# Altium project ТЕИЯ.464511.002 main.PrjPcb (part 2 of 3)

## Sheet Модуль MCU.SchDoc
size 420 x 297 mm; DocumentNumber: 8; SheetNumber: 8; SheetTotal: 11; ListNumber: 1
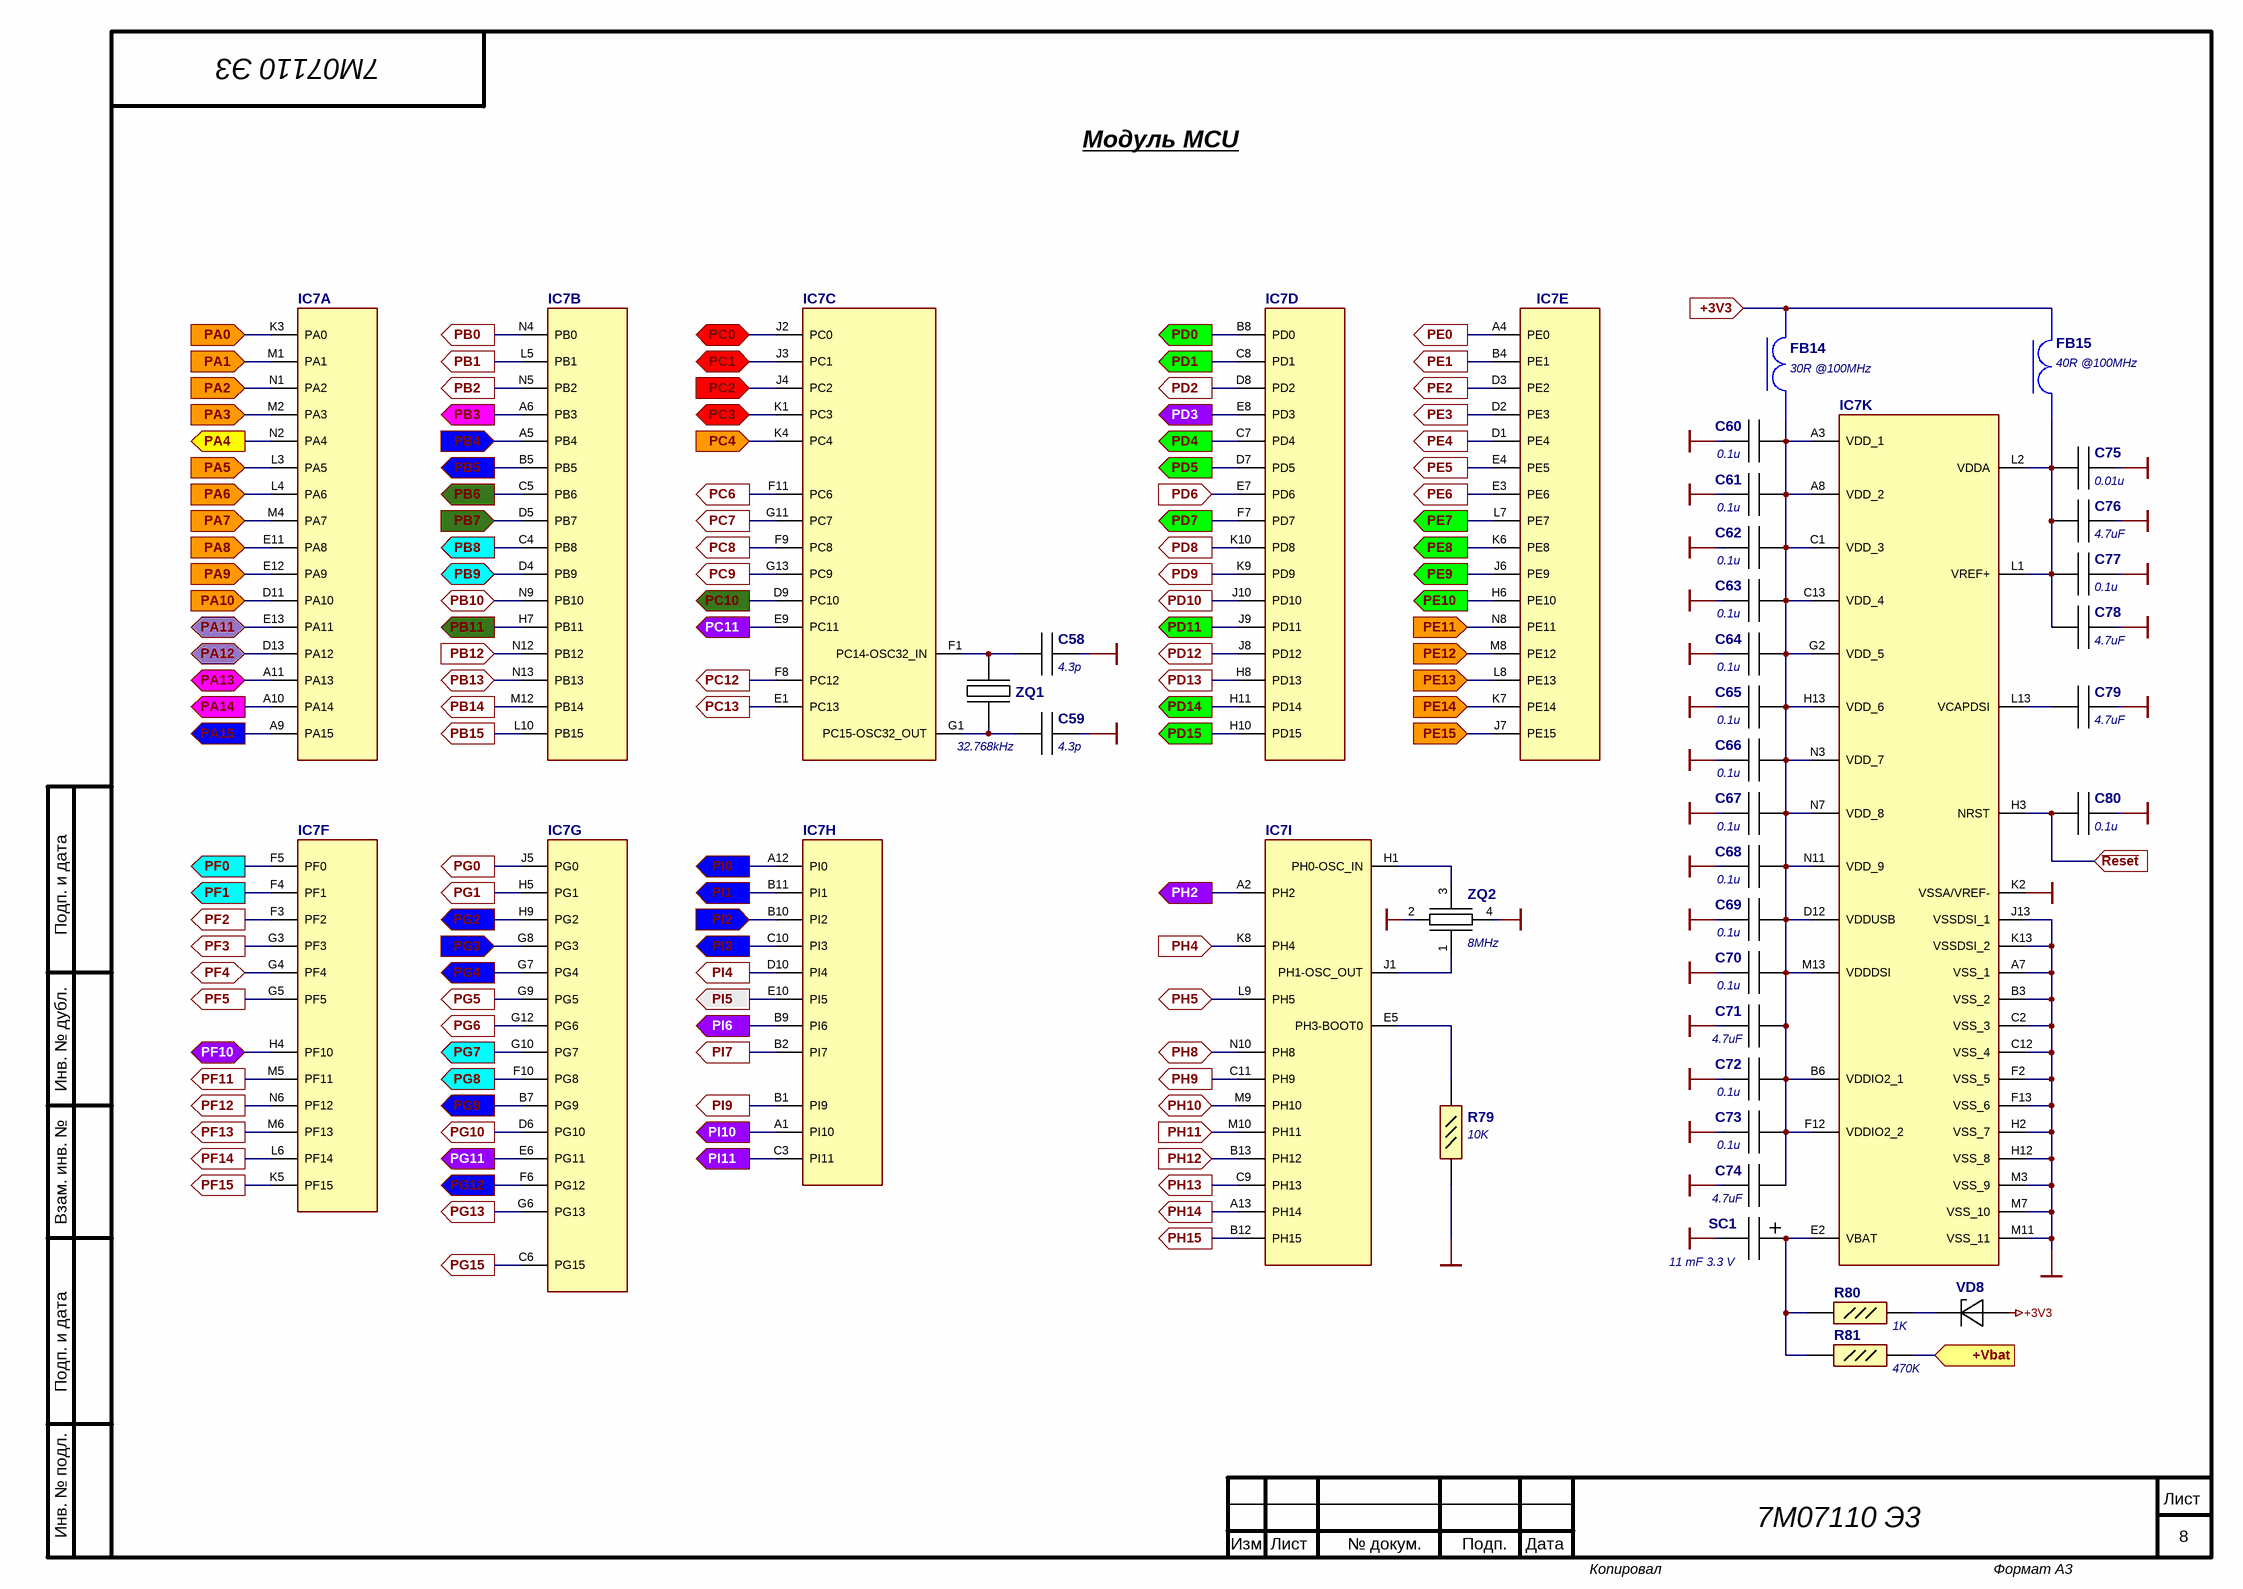
[diagram p5: Модуль MCU.SchDoc]

### Parts
C58  4.3p  [:CAP0402 100x50x50]
C59  4.3p  [:CAP0402 100x50x50]
C60  0.1u  [:CAP0402 100x50x50]
C61  0.1u  [:CAP0402 100x50x50]
C62  0.1u  [:CAP0402 100x50x50]
C63  0.1u  [:CAP0402 100x50x50]
C64  0.1u  [:CAP0402 100x50x50]
C65  0.1u  [:CAP0402 100x50x50]
C66  0.1u  [:CAP0402 100x50x50]
C67  0.1u  [:CAP0402 100x50x50]
C68  0.1u  [:CAP0402 100x50x50]
C69  0.1u  [:CAP0402 100x50x50]
C70  0.1u  [:CAP0402 100x50x50]
C71  4.7uF  [:CAP0805 C2012X125]
C72  0.1u  [:CAP0402 100x50x50]
C73  0.1u  [:CAP0402 100x50x50]
C74  4.7uF  [:CAP0805 C2012X125]
C75  0.01u  [:CAP0402 100x50x50]
C76  4.7uF  [:CAP0805 C2012X125]
C77  0.1u  [:CAP0402 100x50x50]
C78  4.7uF  [:CAP0805 C2012X125]
C79  4.7uF  [:CAP0805 C2012X125]
C80  0.1u  [:CAP0402 100x50x50]
FB14  30R @100MHz  [:FER BLM18SP300SN1D]
FB15  40R @100MHz  [:FER MMZ1005Y400CTD25]
IC7  STM32L4S9AII6  [:BGA169 P700X700X60]  (value not drawn)  (parts A,B,C,D,E,F,G,H,I,K of 11)
R79  Manufacturer_Part_Number (part 2: value): 10K  [:RES0402]  (hidden comment: RC0402FR-07)
R80  Manufacturer_Part_Number (part 2: value): 1K  [:RES0402]  (hidden comment: RC0402FR-07)
R81  Manufacturer_Part_Number (part 2: value): 470K  [:RES0402]  (hidden comment: RC0402FR-07)
SC1  11 mF 3.3 V  [:CAP CPH3225A]
VD8  30V 0.1A  [:DIODE SOD-923F]  (value not drawn)
ZQ1  32.768kHz  [:RESO 12.87181]
ZQ2  8MHz  [:RESO LFXTAL069277REEL]

### Ports
+3V3 (in), +Vbat (in), PA0 (in), PA1 (in), PA2 (in), PA3 (in), PA4 (out), PA5 (in), PA6 (in), PA7 (in), PA8 (in), PA9 (in), PA10 (in), PA11 (bidir), PA12 (bidir), PA13 (bidir), PA14 (out), PA15 (out), PB0 (out), PB1 (out), PB2 (out), PB3 (out), PB4 (in), PB5 (out), PB6 (out), PB7 (in), PB8 (out), PB9 (bidir), PB10 (bidir), PB11 (out), PB12 (in), PB13 (bidir), PB14 (out), PB15 (out), PC0 (bidir), PC1 (bidir), PC2 (in), PC3 (bidir), PC4 (in), PC6 (out), PC7 (out), PC8 (out), PC9 (out), PC10 (out), PC11 (out), PC12 (out), PC13 (out), PD0 (out), PD1 (out), PD2 (out), PD3 (out), PD4 (out), PD5 (out), PD6 (in), PD7 (out), PD8 (out), PD9 (out), PD10 (out), PD11 (out), PD12 (out), PD13 (out), PD14 (out), PD15 (out), PE0 (out), PE1 (out), PE2 (out), PE3 (out), PE4 (out), PE5 (out), PE6 (out), PE7 (out), PE8 (out), PE9 (out), PE10 (out), PE11 (in), PE12 (in), PE13 (in), PE14 (in), PE15 (in), PF0 (out), PF1 (out), PF2 (out), PF3 (out), PF4 (bidir), PF5 (out), PF10 (bidir), PF11 (out), PF12 (out), PF13 (out), PF14 (out), PF15 (out), PG0 (out), PG1 (out), PG2 (out), PG3 (in), PG4 (out), PG5 (out), PG6 (out), PG7 (out), PG8 (out), PG9 (out), PG10 (out), PG11 (out), PG12 (out), PG13 (out), PG15 (out), PH2 (out), PH4 (in), PH5 (bidir), PH8 (bidir), PH9 (out), PH10 (bidir), PH11 (in), PH12 (in), PH13 (out), PH14 (out), PH15 (out), PI0 (out), PI1 (out), PI2 (in), PI3 (out), PI4 (out), PI5 (out), PI6 (out), PI7 (out), PI9 (out), PI10 (out), PI11 (out), ~{Reset} (in)

### Nets
+3V3: FB14.2 FB15.1 VD8.2(A) ; port +3V3
GND: C58.2 C59.2 C60.1 C61.1 C62.1 C63.1 C64.1 C65.1 C66.1 C67.1 C68.1 C69.1 C70.1 C71.2 C72.1 C73.1 C74.2 C75.2 C76.2 C77.2 C78.2 C79.2 C80.2 IC7.A7(VSS_1) IC7.B3(VSS_2) IC7.C2(VSS_3) IC7.C12(VSS_4) IC7.F2(VSS_5) IC7.F13(VSS_6) IC7.H2(VSS_7) IC7.H12(VSS_8) IC7.J13(VSSDSI_1) IC7.K2(VSSA/VREF-) IC7.K13(VSSDSI_2) IC7.M3(VSS_9) IC7.M7(VSS_10) IC7.M11(VSS_11) R79.1 SC1.2(-) ZQ2.2 ZQ2.4
PS_10V5_ON: IC7.J5(PG0) ; port PG0
PS_14V_ON: IC7.L6(PF14) ; port PF14
PS_-5V_ON: IC7.E3(PE6) ; port PE6
NetC1_1: IC7.D13(PA12) ; port PA12
NetC2_1: IC7.E13(PA11) ; port PA11
NetC3_1: IC7.A6(PB3) ; port PB3
NetC4_1: IC7.K7(PE14) ; port PE14
NetC5_1: IC7.D5(PB7) ; port PB7
NetC6_1: IC7.A10(PA14) ; port PA14
NetC7_1: C80.1 IC7.H3(NRST) ; port ~{Reset}
NetC8_1: IC7.C5(PB6) ; port PB6
NetC9_1: IC7.A11(PA13) ; port PA13
NetC10_1: IC7.D9(PC10) ; port PC10
NetC58_1: C58.1 IC7.F1(PC14-OSC32_IN) ZQ1.2
NetC59_1: C59.1 IC7.G1(PC15-OSC32_OUT) ZQ1.1
NetC60_2: C60.2 C61.2 C62.2 C63.2 C64.2 C65.2 C66.2 C67.2 C68.2 C69.2 C70.2 C71.1 C72.2 C73.2 C74.1 FB14.1 IC7.A3(VDD_1) IC7.A8(VDD_2) IC7.B6(VDDIO2_1) IC7.C1(VDD_3) IC7.C13(VDD_4) IC7.D12(VDDUSB) IC7.F12(VDDIO2_2) IC7.G2(VDD_5) IC7.H13(VDD_6) IC7.M13(VDDDSI) IC7.N3(VDD_7) IC7.N7(VDD_8) IC7.N11(VDD_9)
NetC75_1: C75.1 C76.1 C77.1 C78.1 FB15.2 IC7.L1(VREF+) IC7.L2(VDDA)
NetC79_1: C79.1 IC7.L13(VCAPDSI)
NetIC7_A1: IC7.A1(PI10) ; port PI10
NetIC7_A2: IC7.A2(PH2) ; port PH2
NetIC7_A4: IC7.A4(PE0) ; port PE0
NetIC7_A5: IC7.A5(PB4) ; port PB4
NetIC7_A9: IC7.A9(PA15) ; port PA15
NetIC7_A12: IC7.A12(PI0) ; port PI0
NetIC7_A13: IC7.A13(PH14) ; port PH14
NetIC7_B1: IC7.B1(PI9) ; port PI9
NetIC7_B2: IC7.B2(PI7) ; port PI7
NetIC7_B4: IC7.B4(PE1) ; port PE1
NetIC7_B5: IC7.B5(PB5) ; port PB5
NetIC7_B7: IC7.B7(PG9) ; port PG9
NetIC7_B8: IC7.B8(PD0) ; port PD0
NetIC7_B9: IC7.B9(PI6) ; port PI6
NetIC7_B10: IC7.B10(PI2) ; port PI2
NetIC7_B11: IC7.B11(PI1) ; port PI1
NetIC7_B12: IC7.B12(PH15) ; port PH15
NetIC7_B13: IC7.B13(PH12) ; port PH12
NetIC7_C3: IC7.C3(PI11) ; port PI11
NetIC7_C4: IC7.C4(PB8) ; port PB8
NetIC7_C6: IC7.C6(PG15) ; port PG15
NetIC7_C7: IC7.C7(PD4) ; port PD4
NetIC7_C8: IC7.C8(PD1) ; port PD1
NetIC7_C9: IC7.C9(PH13) ; port PH13
NetIC7_C10: IC7.C10(PI3) ; port PI3
NetIC7_C11: IC7.C11(PH9) ; port PH9
NetIC7_D1: IC7.D1(PE4) ; port PE4
NetIC7_D2: IC7.D2(PE3) ; port PE3
NetIC7_D3: IC7.D3(PE2) ; port PE2
NetIC7_D4: IC7.D4(PB9) ; port PB9
NetIC7_D6: IC7.D6(PG10) ; port PG10
NetIC7_D7: IC7.D7(PD5) ; port PD5
NetIC7_D8: IC7.D8(PD2) ; port PD2
NetIC7_D10: IC7.D10(PI4) ; port PI4
NetIC7_D11: IC7.D11(PA10) ; port PA10
NetIC7_E1: IC7.E1(PC13) ; port PC13
NetIC7_E2: IC7.E2(VBAT) R80.2 R81.2 SC1.1(+)
NetIC7_E4: IC7.E4(PE5) ; port PE5
NetIC7_E5: IC7.E5(PH3-BOOT0) R79.2
NetIC7_E6: IC7.E6(PG11) ; port PG11
NetIC7_E7: IC7.E7(PD6) ; port PD6
NetIC7_E8: IC7.E8(PD3) ; port PD3
NetIC7_E9: IC7.E9(PC11) ; port PC11
NetIC7_E10: IC7.E10(PI5) ; port PI5
NetIC7_E11: IC7.E11(PA8) ; port PA8
NetIC7_E12: IC7.E12(PA9) ; port PA9
NetIC7_F3: IC7.F3(PF2) ; port PF2
NetIC7_F4: IC7.F4(PF1) ; port PF1
NetIC7_F5: IC7.F5(PF0) ; port PF0
NetIC7_F6: IC7.F6(PG12) ; port PG12
NetIC7_F7: IC7.F7(PD7) ; port PD7
NetIC7_F8: IC7.F8(PC12) ; port PC12
NetIC7_F9: IC7.F9(PC8) ; port PC8
NetIC7_F10: IC7.F10(PG8) ; port PG8
NetIC7_F11: IC7.F11(PC6) ; port PC6
NetIC7_G3: IC7.G3(PF3) ; port PF3
NetIC7_G4: IC7.G4(PF4) ; port PF4
NetIC7_G5: IC7.G5(PF5) ; port PF5
NetIC7_G6: IC7.G6(PG13) ; port PG13
NetIC7_G7: IC7.G7(PG4) ; port PG4
NetIC7_G8: IC7.G8(PG3) ; port PG3
NetIC7_G9: IC7.G9(PG5) ; port PG5
NetIC7_G10: IC7.G10(PG7) ; port PG7
NetIC7_G11: IC7.G11(PC7) ; port PC7
NetIC7_G12: IC7.G12(PG6) ; port PG6
NetIC7_G13: IC7.G13(PC9) ; port PC9
NetIC7_H1: IC7.H1(PH0-OSC_IN) ZQ2.3
NetIC7_H4: IC7.H4(PF10) ; port PF10
NetIC7_H5: IC7.H5(PG1) ; port PG1
NetIC7_H6: IC7.H6(PE10) ; port PE10
NetIC7_H7: IC7.H7(PB11) ; port PB11
NetIC7_H8: IC7.H8(PD13) ; port PD13
NetIC7_H9: IC7.H9(PG2) ; port PG2
NetIC7_H10: IC7.H10(PD15) ; port PD15
NetIC7_H11: IC7.H11(PD14) ; port PD14
NetIC7_J1: IC7.J1(PH1-OSC_OUT) ZQ2.1
NetIC7_J2: IC7.J2(PC0) ; port PC0
NetIC7_J3: IC7.J3(PC1) ; port PC1
NetIC7_J4: IC7.J4(PC2) ; port PC2
NetIC7_J6: IC7.J6(PE9) ; port PE9
NetIC7_J7: IC7.J7(PE15) ; port PE15
NetIC7_J8: IC7.J8(PD12) ; port PD12
NetIC7_J9: IC7.J9(PD11) ; port PD11
NetIC7_J10: IC7.J10(PD10) ; port PD10
NetIC7_K1: IC7.K1(PC3) ; port PC3
NetIC7_K3: IC7.K3(PA0) ; port PA0
NetIC7_K4: IC7.K4(PC4) ; port PC4
NetIC7_K5: IC7.K5(PF15) ; port PF15
NetIC7_K6: IC7.K6(PE8) ; port PE8
NetIC7_K8: IC7.K8(PH4) ; port PH4
NetIC7_K9: IC7.K9(PD9) ; port PD9
NetIC7_K10: IC7.K10(PD8) ; port PD8
NetIC7_L3: IC7.L3(PA5) ; port PA5
NetIC7_L4: IC7.L4(PA6) ; port PA6
NetIC7_L5: IC7.L5(PB1) ; port PB1
NetIC7_L7: IC7.L7(PE7) ; port PE7
NetIC7_L8: IC7.L8(PE13) ; port PE13
NetIC7_L9: IC7.L9(PH5) ; port PH5
NetIC7_L10: IC7.L10(PB15) ; port PB15
NetIC7_M1: IC7.M1(PA1) ; port PA1
NetIC7_M2: IC7.M2(PA3) ; port PA3
NetIC7_M4: IC7.M4(PA7) ; port PA7
NetIC7_M5: IC7.M5(PF11) ; port PF11
NetIC7_M6: IC7.M6(PF13) ; port PF13
NetIC7_M8: IC7.M8(PE12) ; port PE12
NetIC7_M9: IC7.M9(PH10) ; port PH10
NetIC7_M10: IC7.M10(PH11) ; port PH11
NetIC7_M12: IC7.M12(PB14) ; port PB14
NetIC7_N1: IC7.N1(PA2) ; port PA2
NetIC7_N2: IC7.N2(PA4) ; port PA4
NetIC7_N4: IC7.N4(PB0) ; port PB0
NetIC7_N5: IC7.N5(PB2) ; port PB2
NetIC7_N6: IC7.N6(PF12) ; port PF12
NetIC7_N8: IC7.N8(PE11) ; port PE11
NetIC7_N9: IC7.N9(PB10) ; port PB10
NetIC7_N10: IC7.N10(PH8) ; port PH8
NetIC7_N12: IC7.N12(PB12) ; port PB12
NetIC7_N13: IC7.N13(PB13) ; port PB13
NetR50_1: R81.1 ; port +Vbat
NetR80_1: R80.1 VD8.1(K)

### Notes on the sheet
- Модуль MCU
- Подп. и дата
- Инв. № дубл.
- Взам. инв. №
- Инв. № подл.
- Лист
- Изм.
- № докум.
- Подп.
- Дата
- Копировал
- Формат А3

### Library data of the parts
C58 C59 = GJM1555C1H4R3CB01D: CAP CER  50V C0G/NP0 0402; Manufacturer_Name: Murata Electronics; Short Description: 0402 4.3p 50V; Manufacturer_Part_Number: GJM1555C1H4R3CB01D
C60-C70 C72 C73 C77 C80 = GRM155R71E104KE14J: ±10% 25V Ceramic Capacitor X7R 0402 (1005 Metric); Manufacturer_Name: Murata Electronics; Short Description: 0402 0.1uF 25V; Datasheet Link: http://www.murata.com/~/media/webrenewal/support/library/catalog/products/capacitor/mlcc/c02e.pdf; Height: 0.55mm; Manufacturer_Part_Number: GRM155R71E104KE14J; Mouser Part Number: 81-GRM155R71E104KE4J; Mouser Price/Stock: https://www.mouser.co.uk/ProductDetail/Murata-Electronics/GRM155R71E104KE14J?qs=hNud%2FORuBR2EQtvG2InwAQ%3D%3D; Arrow Part Number: GRM155R71E104KE14J; Arrow Price/Stock: https://www.arrow.com/en/products/grm155r71e104ke14j/murata-manufacturing
C71 C74 C76 C78 C79 = GRM21BZ71E475KE15L: CAP CER 4.7uF 25V X7R 0805; Manufacturer_Name: Murata Electronics; Short Description: 0805 4.7uF 25V; Datasheet Link: https://search.murata.co.jp/Ceramy/image/img/A01X/G101/ENG/GRM21BZ71E475KE15-01.pdf; Height: 1.45mm; Manufacturer_Part_Number: GRM21BZ71E475KE15L
C75 = GRM1555CYA103JE01D: ±5% 35V Ceramic Capacitor C0G, NP0 0402 (1005 Metric); Manufacturer_Name: Murata Electronics; Short Description: 0402 0.01u 35V; Datasheet Link: https://search.murata.co.jp/Ceramy/image/img/A01X/G101/ENG/GRM1555CYA103JE01-01A.pdf; Height: 0.55mm; Manufacturer_Part_Number: GRM1555CYA103JE01D
FB14 = BLM18SP300SN1D: 30 Ohms @ 100MHz 1 Power Line Ferrite Bead 0603 (1608 Metric) 6A 8mOhm; Manufacturer_Name: Murata Electronics; Short Description: 0603 30R @100MHz; Datasheet Link: http://www.murata.com/~/media/webrenewal/support/library/catalog/products/emc/emifil/c31e.ashx?la=en-gb; Height: 0.95mm; Manufacturer_Part_Number: BLM18SP300SN1D; Mouser Part Number: 81-BLM18SP300SN1D; Mouser Price/Stock: https://www.mouser.co.uk/ProductDetail/Murata-Electronics/BLM18SP300SN1D/?qs=W%2FMpXkg%252BdQ4o%252BOP%252B6m8FYA%3D%3D
FB15 = MMZ1005Y400CTD25: 40 Ohms @ 100MHz 1 Signal Line Ferrite Bead 0402 (1005 Metric) 550mA 100mOhm; Manufacturer_Name: TDK; Short Description: 0402 40R @100MHz; Datasheet Link: https://www.arrow.com/en/products/mmz1005y400ctd25/tdk; Height: 0.55mm; Manufacturer_Part_Number: MMZ1005Y400CTD25; Mouser Part Number: 810-MMZ1005Y400CTD25; Mouser Price/Stock: https://www.mouser.com/Search/Refine.aspx?Keyword=810-MMZ1005Y400CTD25; Arrow Part Number: MMZ1005Y400CTD25; Arrow Price/Stock: https://www.arrow.com/en/products/mmz1005y400ctd25/tdk
IC7 = STM32L4S9AII6: MCU 32BIT 2MB FLASH; Manufacturer_Name: STMicroelectronics; Datasheet Link: https://www.arrow.com/en/products/stm32l4s9aii6/stmicroelectronics; Height: 0.6mm; Manufacturer_Part_Number: STM32L4S9AII6; Mouser Part Number: 511-STM32L4S9AII6; Mouser Price/Stock: https://www.mouser.co.uk/ProductDetail/STMicroelectronics/STM32L4S9AII6?qs=wd5RIQLrsJhTDo%252BO4Z5Vcw%3D%3D; Arrow Part Number: STM32L4S9AII6; Arrow Price/Stock: https://www.arrow.com/en/products/stm32l4s9aii6/stmicroelectronics
R79-R81 = RC0402FR-07: as R1 on sheet 7М07110 Э3; Datasheet Link: http://www.yageo.com/documents/recent/PYu-RC0402_51_RoHS_L_6_r.pdf; Height: 0.4mm; Manufacturer_Part_Number: RC0402FR-07; Parameter 1: *
SC1 = CPH3225A: 11 mF (EDLC) Supercapacitor 3.3 V 1210 (3225 Metric); Manufacturer_Name: Seiko Instruments Micro Energy; Short Description: 1210 11mF 3.3V; Datasheet Link: https://www.sii.co.jp/en/me/datasheets/chip-capacitor/cph3225a/; Height: 1mm; Manufacturer_Part_Number: CPH3225A; Mouser Part Number: 628-CPH3225A; Mouser Price/Stock: https://www.mouser.com/Search/Refine.aspx?Keyword=628-CPH3225A
VD8 = CDBQR0130R: Diodes Schottky 0402 30V 0.1A; Manufacturer_Name: Comchip Technology; Datasheet Link: http://www.comchiptech.com/admin/files/product/CDBQR0130R-HF-RevC796140.pdf; Height: 0.55mm; Manufacturer_Part_Number: CDBQR0130R; Mouser Part Number: 750-CDBQR0130R; Mouser Price/Stock: https://www.mouser.co.uk/ProductDetail/Comchip-Technology/CDBQR0130R?qs=tw%252BuQ%2FB6PO3SSBtQ52w%2FCg%3D%3D; Arrow Part Number: CDBQR0130R; Arrow Price/Stock: https://www.arrow.com/en/products/cdbqr0130r/comchip-technology; Short Description: 0402 30V 0.1A
ZQ1 = 12.87181: CRYSTAL 32.7680KHZ / ±20ppm Crystal 12.5pF 2-SMD / ESR: 70 kOhms; Manufacturer_Name: Geyer Electronic America, Inc.; Manufacturer_Part_Number: 12.87181; Short Description: 32.768kHz
ZQ2 = LFXTAL069277REEL: CRYSTAL 8MHz / ±20ppm Crystal 20pF 4-SMD / ESR: 150 Ohms; Manufacturer_Name: IQD Frequency Products; Manufacturer_Part_Number: LFXTAL069277REEL; Short Description: 8MHz

## Sheet Модуль MMI.SchDoc
size 209 x 297 mm; DocumentNumber: 6; SheetNumber: 6; SheetTotal: 11; ListNumber: 1
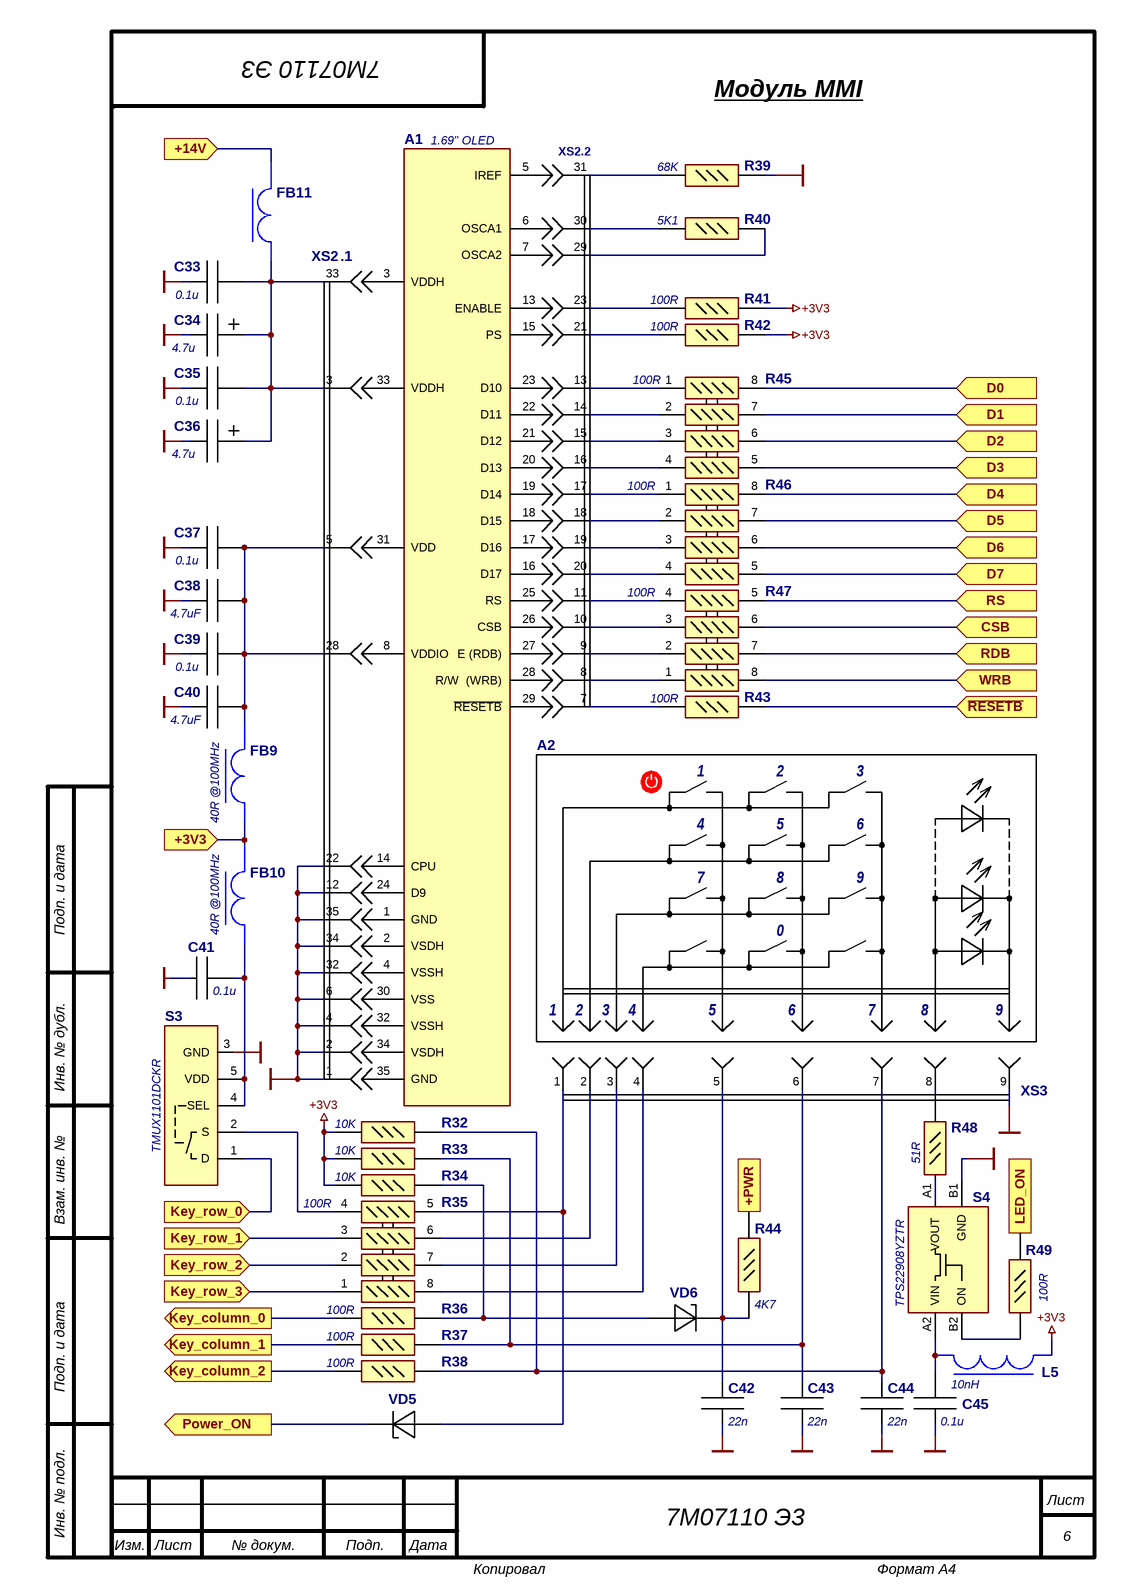
[diagram p6: Модуль MMI.SchDoc]

### Parts
A1  1.69" OLED
A2  (no value)
C33  0.1u  [:CAP0402 100x50x50]
C34  4.7u  [:CAP1206 C3216-18]
C35  0.1u  [:CAP0402 100x50x50]
C36  4.7u  [:CAP1206 C3216-18]
C37  0.1u  [:CAP0402 100x50x50]
C38  4.7uF  [:CAP0805 C2012X125]
C39  0.1u  [:CAP0402 100x50x50]
C40  4.7uF  [:CAP0805 C2012X125]
C41  0.1u  [:CAP0402 100x50x50]
C42  22n  [:CAP0402 100x50x50]
C43  22n  [:CAP0402 100x50x50]
C44  22n  [:CAP0402 100x50x50]
C45  0.1u  [:CAP0402 100x50x50]
FB9  40R @100MHz  [:FER MMZ1005Y400CTD25]
FB10  40R @100MHz  [:FER MMZ1005Y400CTD25]
FB11  40R @100MHz  [:FER MMZ1005Y400CTD25]  (value not drawn)
L5  10nH  [:IND 0402]
R32  Manufacturer_Part_Number (part 2: value): 10K  [:RES0402]  (hidden comment: RC0402FR-07)
R33  Manufacturer_Part_Number (part 2: value): 10K  [:RES0402]  (hidden comment: RC0402FR-07)
R34  Manufacturer_Part_Number (part 2: value): 10K  [:RES0402]  (hidden comment: RC0402FR-07)
R35  100R  [:RES0402x4]
R36  Manufacturer_Part_Number (part 2: value): 100R  [:RES0402]  (hidden comment: RC0402FR-07)
R37  Manufacturer_Part_Number (part 2: value): 100R  [:RES0402]  (hidden comment: RC0402FR-07)
R38  Manufacturer_Part_Number (part 2: value): 100R  [:RES0402]  (hidden comment: RC0402FR-07)
R39  Manufacturer_Part_Number (part 2: value): 68K  [:RES0402]  (hidden comment: RC0402FR-07)
R40  Manufacturer_Part_Number (part 2: value): 5K1  [:RES0402]  (hidden comment: RC0402FR-07)
R41  Manufacturer_Part_Number (part 2: value): 100R  [:RES0402]  (hidden comment: RC0402FR-07)
R42  Manufacturer_Part_Number (part 2: value): 100R  [:RES0402]  (hidden comment: RC0402FR-07)
R43  Manufacturer_Part_Number (part 2: value): 100R  [:RES0402]  (hidden comment: RC0402FR-07)
R44  Manufacturer_Part_Number (part 2: value): 4K7  [:RES0402]  (hidden comment: RC0402FR-07)
R45  100R  [:RES0402x4]
R46  100R  [:RES0402x4]
R47  100R  [:RES0402x4]
R48  Manufacturer_Part_Number (part 2: value): 51R  [:RES0402]  (hidden comment: RC0402FR-07)
R49  Manufacturer_Part_Number (part 2: value): 100R  [:RES0402]  (hidden comment: RC0402FR-07)
S3  TMUX1101DCKR  [:SC70 (5) P200X125X10]
S4  TPS22908YZTR  [:BGA4 P90X90X50]
VD5  30V 0.1A  [:DIODE SOD-923F]  (value not drawn)
VD6  30V 0.1A  [:DIODE SOD-923F]  (value not drawn)
XS2  0541043531  [541043531]  (value not drawn)
XS3  XF3M-0915-1B  [:CON XF3M-0915-1B]  (value not drawn)

### Ports
+3V3 (in), +14V (in), +PWR (in), CSB (in), D0 (in), D1 (in), D2 (in), D3 (in), D4 (in), D5 (in), D6 (in), D7 (in), Key_column_0 (out), Key_column_1 (out), Key_column_2 (out), Key_row_0 (in), Key_row_1 (in), Key_row_2 (in), Key_row_3 (in), LED_ON (in), Power_ON (out), RDB (in), RS (in), WRB (in), ~{RESETB} (in)

### Nets
+3V3: FB9.1 FB10.2 L5.2 R32.2 R33.2 R34.2 R41.2 R42.2 ; port +3V3
+14V: FB11.2 ; port +14V
+PWR: R44.1 ; port +PWR
GND: C33.1 C34.2 C35.1 C36.2 C37.1 C38.2 C39.1 C40.2 C41.1 C42.1 C43.1 C44.1 C45.2 R39.2 S3.3(GND) S4.B1(GND) XS2.1 XS2.2 XS2.4 XS2.6 XS2.12 XS2.22 XS2.32 XS2.34 XS2.35 XS3.9
PS_3V3_ON: VD5.1(K) ; port Power_ON
NetC33_2: C33.2 C34.1(+) C35.2 C36.1(+) FB11.1 XS2.3 XS2.33
NetC37_2: C37.2 C38.1 C39.2 C40.1 FB9.2 XS2.5 XS2.28
NetC41_2: C41.2 FB10.1 S3.4(SEL) S3.5(VDD)
NetC42_2: C42.2 R44.2 VD6.1(K) XS3.5
NetC43_2: C43.2 R33.1 R37.2 XS3.6
NetC44_2: C44.2 R32.1 R38.2 XS3.7
NetC45_1: C45.1 L5.1 S4.A2(VIN)
NetIC7_B2: R35.1 ; port Key_row_3
NetIC7_B8: R45.6 ; port D2
NetIC7_C7: R47.7 ; port RDB
NetIC7_C8: R45.5 ; port D3
NetIC7_D1: S3.1(D) ; port Key_row_0
NetIC7_D2: R35.3 ; port Key_row_1
NetIC7_D3: R35.2 ; port Key_row_2
NetIC7_D7: R47.8 ; port WRB
NetIC7_E4: R49.1 ; port LED_ON
NetIC7_F5: R43.2 ; port ~{RESETB}
NetIC7_F7: R47.6 ; port CSB
NetIC7_H6: R46.5 ; port D7
NetIC7_H10: R45.7 ; port D1
NetIC7_H11: R45.8 ; port D0
NetIC7_J6: R46.6 ; port D6
NetIC7_J9: R47.5 ; port RS
NetIC7_K6: R46.7 ; port D5
NetIC7_L7: R46.8 ; port D4
NetIC7_M1: R37.1 ; port Key_column_1
NetIC7_M2: R36.1 ; port Key_column_0
NetIC7_N1: R38.1 ; port Key_column_2
NetR34_1: R34.1 R36.2 VD6.2(A)
NetR35_4: R35.4 S3.2(S)
NetR35_5: R35.5 VD5.2(A) XS3.1
NetR35_6: R35.6 XS3.2(ч)
NetR35_7: R35.7 XS3.3
NetR35_8: R35.8 XS3.4
NetR39_1: R39.1 XS2.31
NetR40_1: R40.1 XS2.30
NetR40_2: R40.2 XS2.29
NetR41_1: R41.1 XS2.23
NetR42_1: R42.1 XS2.21
NetR43_1: R43.1 XS2.7
NetR45_1: R45.1 XS2.13
NetR45_2: R45.2 XS2.14
NetR45_3: R45.3 XS2.15
NetR45_4: R45.4 XS2.16
NetR46_1: R46.1 XS2.17
NetR46_2: R46.2 XS2.18
NetR46_3: R46.3 XS2.19
NetR46_4: R46.4 XS2.20
NetR47_1: R47.1 XS2.8
NetR47_2: R47.2 XS2.9
NetR47_3: R47.3 XS2.10
NetR47_4: R47.4 XS2.11
NetR48_1: R48.1 XS3.8
NetR48_2: R48.2 S4.A1(VOUT)
NetR49_2: R49.2 S4.B2(ON)

Not connected (* = marked no-connect by the designer): A1 1(GND) 2(VSDH) 3(VDDH) 4(VSSH) 5(IREF) 6(OSCA1) 7(OSCA2) 8(VDDIO) 13(ENABLE) 14(CPU) 15(PS) 16(D17) 17(D16) 18(D15) 19(D14) 20(D13) 21(D12) 22(D11) 23(D10) 24(D9) 25(RS) 26(CSB) 27(E_(RDB)) 28(R/W__(WRB)) 29(~{RESETB}) 30(VSS) 31(VDD) 32(VSSH) 33(VDDH) 34(VSDH) 35(GND)

### Notes on the sheet
- Модуль MMI
- (near XS2) XS2.2
- (near XS2) .1
- Подп. и дата
- Инв. № дубл.
- Взам. инв. №
- Инв. № подл.
- Лист
- Изм.
- № докум.
- Подп.
- Дата
- Копировал
- Формат А4
- (in symbol Клавиатура 3x4 (Заказ №...)) 1; 2; 3; 4; 5; 6; 7; 8; 9; 0

### Library data of the parts
A1 = NHD-1.69-160128G: Graphic LCD Display Module Transflective (RGB) / OLED Parallel, Serial 1.69" (42.93mm) 160 x 128; Manufacturer_Name: Newhaven Display; Manufacturer_Part_Number: NHD-1.69-160128G; Short Description: 1.69" OLED
A2 = Клавиатура 3x4 (Заказ №...): Клавиатура мембранная с подсветкой / Для серии будем заказывать изгтовление клавиатуры с подсветко по нашему ТЗ.; Manufacturer_Name: ООО «ИНЕЛСО»; Manufacturer_Part_Number: Клавиатура 5042 ТЕИЯ.464511.002 ТЗ
C33 C35 C37 C39 C41 C45 = GRM155R71E104KE14J: as C60 on sheet Модуль MCU; Datasheet Link: http://www.murata.com/~/media/webrenewal/support/library/catalog/products/capacitor/mlcc/c02e.pdf; Height: 0.55mm; Manufacturer_Part_Number: GRM155R71E104KE14J; Mouser Part Number: 81-GRM155R71E104KE4J; Mouser Price/Stock: https://www.mouser.co.uk/ProductDetail/Murata-Electronics/GRM155R71E104KE14J?qs=hNud%2FORuBR2EQtvG2InwAQ%3D%3D; Arrow Part Number: GRM155R71E104KE14J; Arrow Price/Stock: https://www.arrow.com/en/products/grm155r71e104ke14j/murata-manufacturing
C34 C36 = T491A475K025AT: 4.7µF Molded Tantalum Capacitors 25V 1206 (3216 Metric) 50mOhm; Manufacturer_Name: KEMET; Short Description: 1206 4.7µF 25V; Manufacturer_Part_Number: T491A475K025AT
C38 C40 = GRM21BZ71E475KE15L: as C71 on sheet Модуль MCU; Datasheet Link: https://search.murata.co.jp/Ceramy/image/img/A01X/G101/ENG/GRM21BZ71E475KE15-01.pdf; Height: 1.45mm; Manufacturer_Part_Number: GRM21BZ71E475KE15L
C42-C44 = GCM155R71E223KA55D: CAP CER  25V X7R 0402; Manufacturer_Name: Murata Electronics; Short Description: 0402 22n 25V; Manufacturer_Part_Number: GCM155R71E223KA55D
FB9-FB11 = MMZ1005Y400CTD25: as FB15 on sheet Модуль MCU; Datasheet Link: https://www.arrow.com/en/products/mmz1005y400ctd25/tdk; Height: 0.55mm; Manufacturer_Part_Number: MMZ1005Y400CTD25; Mouser Part Number: 810-MMZ1005Y400CTD25; Mouser Price/Stock: https://www.mouser.com/Search/Refine.aspx?Keyword=810-MMZ1005Y400CTD25; Arrow Part Number: MMZ1005Y400CTD25; Arrow Price/Stock: https://www.arrow.com/en/products/mmz1005y400ctd25/tdk
L5 = LQG15HN10NJ02D: Unshielded Multilayer Inductor 0402 5%; Manufacturer_Name: Murata Electronics; Short Description: 10nH 500mA 0.29Ohm; Manufacturer_Part_Number: LQG15HN10NJ02D
R32-R34 R36-R44 R48 R49 = RC0402FR-07: as R1 on sheet 7М07110 Э3; Datasheet Link: http://www.yageo.com/documents/recent/PYu-RC0402_51_RoHS_L_6_r.pdf; Height: 0.4mm; Manufacturer_Part_Number: RC0402FR-07; Parameter 1: *
R35 R45-R47 = EXB-N8V101JX: 100 Ohm ±5% 31mW Power Per Element Isolated 4 Resistor Network/Array ±200ppm/°C 0804, Concave, Long Side Terminals; Manufacturer_Name: Panasonic; Short Description: 0804 5% 100R; Datasheet Link: https://industrial.panasonic.com/cdbs/www-data/pdf/AOC0000/AOC0000C14.pdf; Height: 0.55mm; Manufacturer_Part_Number: EXB-N8V101JX; Mouser Part Number: 667-EXB-N8V101JX; Mouser Price/Stock: https://www.mouser.co.uk/ProductDetail/Panasonic/EXB-N8V101JX?qs=cttFivMKqWxyXyoXALoehw%3D%3D; Arrow Part Number: EXB-N8V101JX; Arrow Price/Stock: https://www.arrow.com/en/products/exbn8v101jx/panasonic
S3 = TMUX1101DCKR: SPST Switch Bidir. 1.8 Ω 30mA 300MHz; Manufacturer_Name: Texas Instruments; Datasheet Link: http://www.ti.com/lit/gpn/TMUX1101; Height: 1.1mm; Manufacturer_Part_Number: TMUX1101DCKR; Mouser Part Number: 595-TMUX1101DCKR; Mouser Price/Stock: https://www.mouser.co.uk/ProductDetail/Texas-Instruments/TMUX1101DCKR?qs=vLWxofP3U2x5rBu7DSMCxw%3D%3D; Arrow Part Number: TMUX1101DCKR; Arrow Price/Stock: https://www.arrow.com/en/products/tmux1101dckr/texas-instruments
S4 = TPS22908YZTR: SPST Switch 3.6-V, 1-A, 28-mΩ; Manufacturer_Name: Texas Instruments; Datasheet Link: http://www.ti.com/lit/gpn/tps22908; Height: 0.625mm; Manufacturer_Part_Number: TPS22908YZTR; Mouser Part Number: 595-TPS22908YZTR; Mouser Price/Stock: https://www.mouser.co.uk/ProductDetail/Texas-Instruments/TPS22908YZTR?qs=4whTb%2F0XQMjgQyC%252BYmbgaA%3D%3D; Arrow Part Number: TPS22908YZTR; Arrow Price/Stock: https://www.arrow.com/en/products/tps22908yztr/texas-instruments
VD5 VD6 = CDBQR0130R: as VD8 on sheet Модуль MCU; Datasheet Link: http://www.comchiptech.com/admin/files/product/CDBQR0130R-HF-RevC796140.pdf; Height: 0.55mm; Manufacturer_Part_Number: CDBQR0130R; Mouser Part Number: 750-CDBQR0130R; Mouser Price/Stock: https://www.mouser.co.uk/ProductDetail/Comchip-Technology/CDBQR0130R?qs=tw%252BuQ%2FB6PO3SSBtQ52w%2FCg%3D%3D; Arrow Part Number: CDBQR0130R; Arrow Price/Stock: https://www.arrow.com/en/products/cdbqr0130r/comchip-technology; Short Description: 0402 30V 0.1A
XS2 = 0541043531: Rotary Backlock Connector 35-pin 0.5mm Pitch, Top side Contact; Manufacturer_Name: Molex; Datasheet Link: https://componentsearchengine.com//54104-3531.pdf; Height: 2mm; Manufacturer_Part_Number: 0541043531; Short Description: 35-pin 0.5mm; Mouser2 Part Number: 538-54104-3531; Mouser2 Price/Stock: https://www.mouser.com/Search/Refine.aspx?Keyword=538-54104-3531
XS3 = XF3M-0915-1B: Rotary Backlock Connector 35-pin 0.5mm Pitch, Dual sided Contact; Manufacturer_Name: OMRON; Short Description: 9-pin 0.5mm; Manufacturer_Part_Number: XF3M-0915-1B

## Sheet Радиомодуль.SchDoc
size 209 x 297 mm; DocumentNumber: 10; SheetNumber: 10; SheetTotal: 11; ListNumber: 1
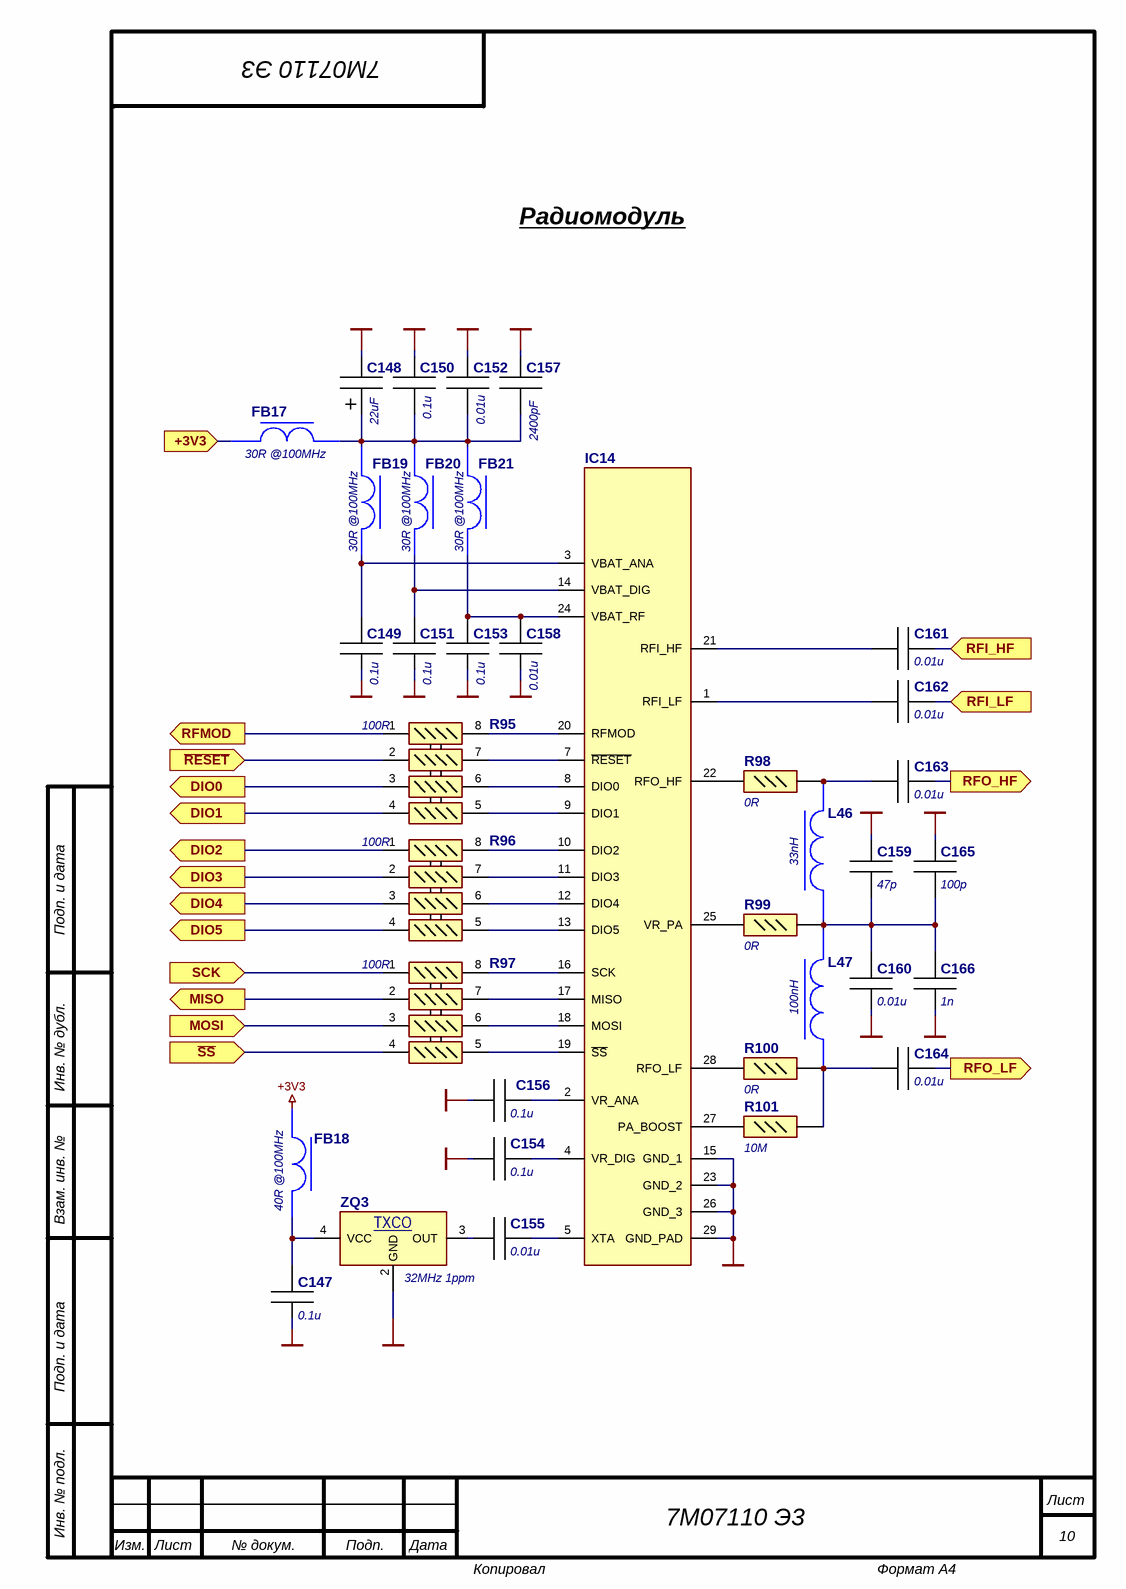
[diagram p7: Радиомодуль.SchDoc]

### Parts
C147  0.1u  [:CAP0402 100x50x50]
C148  22uF  [:CAP1206 C3216-18]
C149  0.1u  [:CAP0402 100x50x50]
C150  0.1u  [:CAP0402 100x50x50]
C151  0.1u  [:CAP0402 100x50x50]
C152  0.01u  [:CAP0402 100x50x50]
C153  0.1u  [:CAP0402 100x50x50]
C154  0.1u  [:CAP0402 100x50x50]
C155  0.01u  [:CAP0402 100x50x50]
C156  0.1u  [:CAP0402 100x50x50]
C157  2400pF  [:CAP0805 C2012X125]
C158  0.01u  [:CAP0402 100x50x50]
C159  47p  [:CAP0402 100x50x50]
C160  0.01u  [:CAP0402 100x50x50]
C161  0.01u  [:CAP0402 100x50x50]
C162  0.01u  [:CAP0402 100x50x50]
C163  0.01u  [:CAP0402 100x50x50]
C164  0.01u  [:CAP0402 100x50x50]
C165  100p  [:CAP0402 100x50x50]
C166  1n  [:CAP0402 100x50x50]
FB17  30R @100MHz  [:FER BLM18SP300SN1D]
FB18  40R @100MHz  [:FER MMZ1005Y400CTD25]
FB19  30R @100MHz  [:FER BLM18SP300SN1D]
FB20  30R @100MHz  [:FER BLM18SP300SN1D]
FB21  30R @100MHz  [:FER BLM18SP300SN1D]
IC14  SX1276IMLTRT  [:QFN28 P600X600X100-29N-D]  (value not drawn)
L46  33nH  [:IND 0603 (1608)]
L47  100nH  [:IND 0603 (1608)]
R95  100R  [:RES0402x4]
R96  100R  [:RES0402x4]
R97  100R  [:RES0402x4]
R98  Manufacturer_Part_Number (part 2: value): 0R  [:RES0402]  (hidden comment: RC0402FR-07)
R99  Manufacturer_Part_Number (part 2: value): 0R  [:RES0402]  (hidden comment: RC0402FR-07)
R100  Manufacturer_Part_Number (part 2: value): 0R  [:RES0402]  (hidden comment: RC0402FR-07)
R101  Manufacturer_Part_Number (part 2: value): 10M  [:RES0402]  (hidden comment: RC0402FR-07)
ZQ3  32MHz 1ppm  [:RESO STC22K33R48-32.000MT]

### Ports
+3V3 (in), DIO0 (out), DIO1 (out), DIO2 (out), DIO3 (out), DIO4 (out), DIO5 (out), MISO (out), MOSI (in), RFI_HF (in), RFI_LF (in), RFMOD (out), RFO_HF (out), RFO_LF (out), SCK (in), ~{RESET} (in), ~{SS} (in)

### Nets
+3V3: FB17.1 FB18.1 ; port +3V3
GND: C147.1 C148.2 C149.1 C150.2 C151.1 C152.2 C153.1 C154.1 C156.1 C157.2 C158.1 C159.1 C160.1 C165.2 C166.1 IC14.15(GND_1) IC14.23(GND_2) IC14.26(GND_3) IC14.29(GND_PAD) ZQ3.2(GND)
NetC88_1: C163.1 ; port RFO_HF
NetC107_1: C161.1 ; port RFI_HF
NetC147_2: C147.2 FB18.2 ZQ3.4(VCC)
NetC148_1: C148.1(+) C150.1 C152.1 C157.1 FB17.2 FB19.1 FB20.1 FB21.1
NetC149_2: C149.2 FB19.2 IC14.3(VBAT_ANA)
NetC151_2: C151.2 FB20.2 IC14.14(VBAT_DIG)
NetC153_2: C153.2 C158.2 FB21.2 IC14.24(VBAT_RF)
NetC154_2: C154.2 IC14.4(VR_DIG)
NetC155_1: C155.1 IC14.5(XTA)
NetC155_2: C155.2 ZQ3.3(OUT)
NetC156_2: C156.2 IC14.2(VR_ANA)
NetC159_2: C159.2 C160.2 C165.1 C166.2 L46.1 L47.1 R99.1
NetC161_2: C161.2 IC14.21(RFI_HF)
NetC162_1: C162.1 ; port RFI_LF
NetC162_2: C162.2 IC14.1(RFI_LF)
NetC163_2: C163.2 L46.2 R98.1
NetC164_1: C164.1 ; port RFO_LF
NetC164_2: C164.2 L47.2 R100.1 R101.1
NetIC7_A9: R97.4 ; port ~{SS}
NetIC7_F11: R95.2 ; port ~{RESET}
NetIC7_G7: R97.3 ; port MOSI
NetIC7_G8: R97.2 ; port MISO
NetIC7_H9: R97.1 ; port SCK
NetIC7_K4: R96.2 ; port DIO3
NetIC7_L3: R95.3 ; port DIO0
NetIC7_L4: R96.1 ; port DIO2
NetIC7_L8: R95.1 ; port RFMOD
NetIC7_M4: R95.4 ; port DIO1
NetIC7_M8: R96.4 ; port DIO5
NetIC7_N8: R96.3 ; port DIO4
NetIC14_7: IC14.7(~{RESET}) R95.7
NetIC14_8: IC14.8(DIO0) R95.6
NetIC14_9: IC14.9(DIO1) R95.5
NetIC14_10: IC14.10(DIO2) R96.8
NetIC14_11: IC14.11(DIO3) R96.7
NetIC14_12: IC14.12(DIO4) R96.6
NetIC14_13: IC14.13(DIO5) R96.5
NetIC14_16: IC14.16(SCK) R97.8
NetIC14_17: IC14.17(MISO) R97.7
NetIC14_18: IC14.18(MOSI) R97.6
NetIC14_19: IC14.19(~{SS}) R97.5
NetIC14_20: IC14.20(RFMOD) R95.8
NetIC14_22: IC14.22(RFO_HF) R98.2
NetIC14_25: IC14.25(VR_PA) R99.2
NetIC14_27: IC14.27(PA_BOOST) R101.2
NetIC14_28: IC14.28(RFO_LF) R100.2

### Notes on the sheet
- Радиомодуль
- Подп. и дата
- Инв. № дубл.
- Взам. инв. №
- Инв. № подл.
- Лист
- Изм.
- № докум.
- Подп.
- Дата
- Копировал
- Формат А4
- (in symbol STC22K33R48-32.000MT) TXCO

### Library data of the parts
C147 C149-C151 C153 C154 C156 = GRM155R71E104KE14J: as C60 on sheet Модуль MCU; Datasheet Link: http://www.murata.com/~/media/webrenewal/support/library/catalog/products/capacitor/mlcc/c02e.pdf; Height: 0.55mm; Manufacturer_Part_Number: GRM155R71E104KE14J; Mouser Part Number: 81-GRM155R71E104KE4J; Mouser Price/Stock: https://www.mouser.co.uk/ProductDetail/Murata-Electronics/GRM155R71E104KE14J?qs=hNud%2FORuBR2EQtvG2InwAQ%3D%3D; Arrow Part Number: GRM155R71E104KE14J; Arrow Price/Stock: https://www.arrow.com/en/products/grm155r71e104ke14j/murata-manufacturing
C148 = TPSA226K006R0300: 22µF Molded Tantalum Capacitors 6.3V 1206 (3216 Metric) 300mOhm @ 100kHz; Manufacturer_Name: AVX; Short Description: 1206 22uF 6V3; Manufacturer_Part_Number: TPSA226K006R0300
C152 C155 C158 C160-C164 = GRM1555CYA103JE01D: as C75 on sheet Модуль MCU; Datasheet Link: https://search.murata.co.jp/Ceramy/image/img/A01X/G101/ENG/GRM1555CYA103JE01-01A.pdf; Height: 0.55mm; Manufacturer_Part_Number: GRM1555CYA103JE01D
C157 = C08BL242X-5UN-X0T: 2400pF 50V Ceramic Capacitor 0805 (2012 Metric); Manufacturer_Name: Knowles Novacap; Short Description: 0805 2400pF 50V; Manufacturer_Part_Number: C08BL242X-5UN-X0T
C159 = GJM1555C1H470GB01D: CAP CER  50V C0G/NP0 0402; Manufacturer_Name: Murata Electronics; Short Description: 0402 47p 50V; Manufacturer_Part_Number: GJM1555C1H470GB01D
C165 = GCM1555C1H101JA16D: CAP CER  50V C0G/NP0 0402; Manufacturer_Name: Murata Electronics; Short Description: 0402 100p 50V; Manufacturer_Part_Number: GCM1555C1H101JA16D
C166 = GRM1555C1H102JA01J: ±5% 50V Ceramic Capacitor C0G, NP0 0402 (1005 Metric); Manufacturer_Name: Murata Electronics; Short Description: 0402 1n 50V; Height: 0.55mm; Manufacturer_Part_Number: GRM1555C1H102JA01J
FB17 FB19-FB21 = BLM18SP300SN1D: as FB14 on sheet Модуль MCU; Datasheet Link: http://www.murata.com/~/media/webrenewal/support/library/catalog/products/emc/emifil/c31e.ashx?la=en-gb; Height: 0.95mm; Manufacturer_Part_Number: BLM18SP300SN1D; Mouser Part Number: 81-BLM18SP300SN1D; Mouser Price/Stock: https://www.mouser.co.uk/ProductDetail/Murata-Electronics/BLM18SP300SN1D/?qs=W%2FMpXkg%252BdQ4o%252BOP%252B6m8FYA%3D%3D
FB18 = MMZ1005Y400CTD25: as FB15 on sheet Модуль MCU; Datasheet Link: https://www.arrow.com/en/products/mmz1005y400ctd25/tdk; Height: 0.55mm; Manufacturer_Part_Number: MMZ1005Y400CTD25; Mouser Part Number: 810-MMZ1005Y400CTD25; Mouser Price/Stock: https://www.mouser.com/Search/Refine.aspx?Keyword=810-MMZ1005Y400CTD25; Arrow Part Number: MMZ1005Y400CTD25; Arrow Price/Stock: https://www.arrow.com/en/products/mmz1005y400ctd25/tdk
IC14 = SX1276IMLTRT: LoRa RF Transceiver 3 BANDS; Manufacturer_Name: SEMTECH; Short Description: LoRa RF; Datasheet Link: https://componentsearchengine.com/Datasheets/1/SX1276IMLTRT.pdf; Height: 1mm; Manufacturer_Part_Number: SX1276IMLTRT; Mouser Part Number: 947-SX1276IMLTRT; Mouser Price/Stock: https://www.mouser.co.uk/ProductDetail/Semtech/SX1276IMLTRT/?qs=rBWM4%252BvDhIceYQoeMKd%2FQQ%3D%3D; Arrow Part Number: SX1276IMLTRT; Arrow Price/Stock: https://www.arrow.com/en/products/sx1276imltrt/semtech
L46 = LQW18AN33NJ8ZD: Unshielded Multilayer Inductor 0603 5%; Manufacturer_Name: Murata Electronics; Short Description: 33nH 1.1A 110mOhm; Manufacturer_Part_Number: LQW18AN33NJ8ZD
L47 = LQW18ANR10J8ZD: Unshielded Multilayer Inductor 0603 5%; Manufacturer_Name: Murata Electronics; Short Description: 100nH 0.19A 0.63Ohm; Manufacturer_Part_Number: LQW18ANR10J8ZD
R95-R97 = EXB-N8V101JX: as R35 on sheet Модуль MMI; Datasheet Link: https://industrial.panasonic.com/cdbs/www-data/pdf/AOC0000/AOC0000C14.pdf; Height: 0.55mm; Manufacturer_Part_Number: EXB-N8V101JX; Mouser Part Number: 667-EXB-N8V101JX; Mouser Price/Stock: https://www.mouser.co.uk/ProductDetail/Panasonic/EXB-N8V101JX?qs=cttFivMKqWxyXyoXALoehw%3D%3D; Arrow Part Number: EXB-N8V101JX; Arrow Price/Stock: https://www.arrow.com/en/products/exbn8v101jx/panasonic
R98-R101 = RC0402FR-07: as R1 on sheet 7М07110 Э3; Datasheet Link: http://www.yageo.com/documents/recent/PYu-RC0402_51_RoHS_L_6_r.pdf; Height: 0.4mm; Manufacturer_Part_Number: RC0402FR-07; Parameter 1: *
ZQ3 = STC22K33R48-32.000MT: 32MHz TCXO Clipped Sine Wave Oscillator 3.3V 2mA 4-SMD, / -40°C ~ 85°C; Manufacturer_Name: Suntsu Electronics, Inc.; Datasheet Link: https://suntsu.com/wp-content/uploads/2019/07/STC22K-Series.pdf; Manufacturer_Part_Number: STC22K33R48-32.000MT; Short Description: 32MHz 1ppm